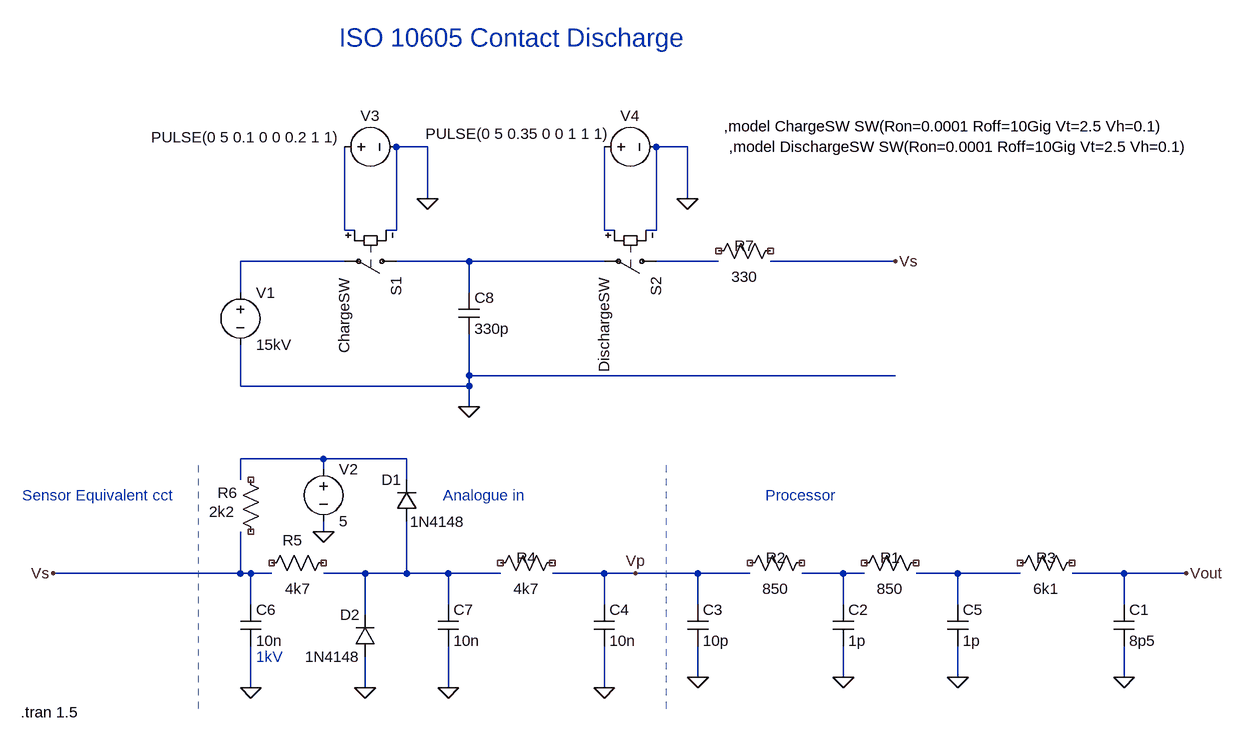
[diagram p0: schematic SPC572L_ADC_ESD.asc]
SPC572L_ADC_ESD.asc, the LTspice schematic file:
Version 4
SHEET 1 920 680
WIRE -320 -448 -368 -448
WIRE 80 -448 32 -448
WIRE -320 -368 -320 -448
WIRE 80 -368 80 -448
WIRE -448 -320 -448 -448
WIRE -432 -320 -448 -320
WIRE -368 -320 -368 -448
WIRE -368 -320 -384 -320
WIRE -48 -320 -48 -448
WIRE -32 -320 -48 -320
WIRE 32 -320 32 -448
WIRE 32 -320 16 -320
WIRE -448 -272 -608 -272
WIRE -256 -272 -368 -272
WIRE -48 -272 -256 -272
WIRE 128 -272 32 -272
WIRE 400 -272 208 -272
WIRE -608 -224 -608 -272
WIRE -256 -224 -256 -272
WIRE -256 -96 -256 -160
WIRE 400 -96 -256 -96
WIRE -608 -80 -608 -144
WIRE -256 -80 -256 -96
WIRE -256 -80 -608 -80
WIRE -256 -48 -256 -80
WIRE -480 32 -608 32
WIRE -352 32 -480 32
WIRE -480 48 -480 32
WIRE -608 64 -608 32
WIRE -352 64 -352 32
WIRE -480 144 -480 128
WIRE -608 208 -608 144
WIRE -608 208 -896 208
WIRE -592 208 -608 208
WIRE -560 208 -592 208
WIRE -416 208 -480 208
WIRE -352 208 -352 128
WIRE -352 208 -416 208
WIRE -288 208 -352 208
WIRE -208 208 -288 208
WIRE -48 208 -128 208
WIRE 0 208 -48 208
WIRE 96 208 0 208
WIRE 176 208 96 208
WIRE 320 208 256 208
WIRE 352 208 320 208
WIRE 496 208 432 208
WIRE 592 208 496 208
WIRE 752 208 672 208
WIRE 848 208 752 208
WIRE -592 256 -592 208
WIRE -288 256 -288 208
WIRE -48 256 -48 208
WIRE 96 256 96 208
WIRE 320 256 320 208
WIRE 496 256 496 208
WIRE 752 256 752 208
WIRE -416 272 -416 208
WIRE 96 368 96 320
WIRE 320 368 320 320
WIRE 496 368 496 320
WIRE 752 368 752 320
WIRE -592 384 -592 320
WIRE -416 384 -416 336
WIRE -288 384 -288 320
WIRE -48 384 -48 320
FLAG 320 368 0
FLAG 752 368 0
FLAG 848 208 Vout
FLAG 96 368 0
FLAG -48 384 0
FLAG 496 368 0
FLAG -592 384 0
FLAG -288 384 0
FLAG 0 208 Vp
FLAG -896 208 Vs
FLAG -416 384 0
FLAG -480 144 0
FLAG -256 -48 0
FLAG 400 -272 Vs
FLAG -320 -368 0
FLAG 80 -368 0
SYMBOL res 272 176 R90
WINDOW 0 24 56 VBottom 2
WINDOW 3 40 56 VTop 2
SYMATTR InstName R2
SYMATTR Value 850
SYMBOL res 688 176 R90
WINDOW 0 24 56 VBottom 2
WINDOW 3 40 56 VTop 2
SYMATTR InstName R3
SYMATTR Value 6k1
SYMBOL cap 736 256 R0
SYMATTR InstName C1
SYMATTR Value 8p5
SYMBOL cap 304 256 R0
SYMATTR InstName C2
SYMATTR Value 1p
SYMBOL res -112 176 R90
WINDOW 0 24 56 VBottom 2
WINDOW 3 40 56 VTop 2
SYMATTR InstName R4
SYMATTR Value 4k7
SYMBOL cap 80 256 R0
SYMATTR InstName C3
SYMATTR Value 10p
SYMBOL cap -64 256 R0
SYMATTR InstName C4
SYMATTR Value 10n
SYMBOL res 448 176 R90
WINDOW 0 24 56 VBottom 2
WINDOW 3 40 56 VTop 2
SYMATTR InstName R1
SYMATTR Value 850
SYMBOL cap 480 256 R0
SYMATTR InstName C5
SYMATTR Value 1p
SYMBOL res -464 176 R90
WINDOW 0 -3 64 VBottom 2
WINDOW 3 40 56 VTop 2
SYMATTR InstName R5
SYMATTR Value 4k7
SYMBOL cap -608 256 R0
SYMATTR InstName C6
SYMATTR Value 10n
SYMBOL res -576 160 R180
WINDOW 0 36 76 Left 2
WINDOW 3 41 47 Left 2
SYMATTR InstName R6
SYMATTR Value 2k2
SYMBOL cap -304 256 R0
SYMATTR InstName C7
SYMATTR Value 10n
SYMBOL diode -336 128 R180
WINDOW 0 24 64 Left 2
WINDOW 3 -74 -1 Left 2
SYMATTR InstName D1
SYMATTR Value 1N4148
SYMBOL diode -400 336 R180
WINDOW 0 24 64 Left 2
WINDOW 3 24 0 Left 2
SYMATTR InstName D2
SYMATTR Value 1N4148
SYMBOL voltage -480 32 R0
WINDOW 123 0 0 Left 2
WINDOW 39 0 0 Left 2
SYMATTR InstName V2
SYMATTR Value 5
SYMBOL voltage -608 -240 R0
WINDOW 123 0 0 Left 0
WINDOW 39 0 0 Left 0
SYMATTR InstName V1
SYMATTR Value 15kV
SYMBOL cap -272 -224 R0
SYMATTR InstName C8
SYMATTR Value 330p
SYMBOL sw -352 -272 R90
SYMATTR InstName S1
SYMATTR Value ChargeSW
SYMBOL sw 48 -272 R90
SYMATTR InstName S2
SYMATTR Value DischargeSW
SYMBOL res 224 -304 R90
WINDOW 0 24 56 VBottom 2
WINDOW 3 40 56 VTop 2
SYMATTR InstName R7
SYMATTR Value 330
SYMBOL voltage -464 -448 R270
WINDOW 0 32 56 VTop 2
WINDOW 3 -1 -136 VTop 2
WINDOW 123 0 0 Left 0
WINDOW 39 0 0 Left 0
SYMATTR InstName V3
SYMATTR Value PULSE(0 5 0.1 0 0 0.2 1 1)
SYMBOL voltage -64 -448 R270
WINDOW 0 32 56 VTop 2
WINDOW 3 36 -117 VBottom 2
WINDOW 123 0 0 Left 0
WINDOW 39 0 0 Left 0
SYMATTR InstName V4
SYMATTR Value PULSE(0 5 0.35 0 0 1 1 1)
TEXT -296 88 Left 2 ;Analogue in
TEXT 200 88 Left 2 ;Processor
TEXT -944 88 Left 2 ;Sensor Equivalent cct
TEXT -584 336 Left 2 ;1kV
TEXT -456 -616 Left 4 ;ISO 10605 Contact Discharge
TEXT 136 -480 Left 2 !,model ChargeSW SW(Ron=0.0001 Roff=10Gig Vt=2.5 Vh=0.1)
TEXT 144 -448 Left 2 !,model DischargeSW SW(Ron=0.0001 Roff=10Gig Vt=2.5 Vh=0.1)
TEXT -946 422 Left 2 !.tran 1.5
LINE Normal 48 416 48 32 2
LINE Normal -672 416 -672 32 2

The netlist it stands for:
* SPC572L_ADC_ESD.asc
R2 NC_01 NC_02 850
R3 NC_03 NC_04 6k1
C1 Vout 0 8p5
C2 N008 0 1p
R4 NC_05 NC_06 4k7
C3 Vp 0 10p
C4 Vp 0 10n
R1 NC_07 NC_08 850
C5 N009 0 1p
R5 NC_09 NC_10 4k7
C6 Vs 0 10n
R6 NC_11 NC_12 2k2
C7 N007 0 10n
D1 N007 N006 1N4148
D2 0 N007 1N4148
V2 N006 0 5
V1 N003 0 15kV
C8 N004 0 330p
S1 N004 N003 N001 0 ChargeSW
S2 N005 N004 N002 0 DischargeSW
R7 NC_13 NC_14 330
V3 N001 0 PULSE(0 5 0.1 0 0 0.2 1 1)
V4 N002 0 PULSE(0 5 0.35 0 0 1 1 1)
.model D D
.lib standard.dio
* Analogue in
* Processor
* Sensor Equivalent cct
* 1kV
* ISO 10605 Contact Discharge
,model ChargeSW SW(Ron=0.0001 Roff=10Gig Vt=2.5 Vh=0.1)
,model DischargeSW SW(Ron=0.0001 Roff=10Gig Vt=2.5 Vh=0.1)
.tran 1.5
.backanno
.end